# Altium project breeze_electronics_design.PrjPcb
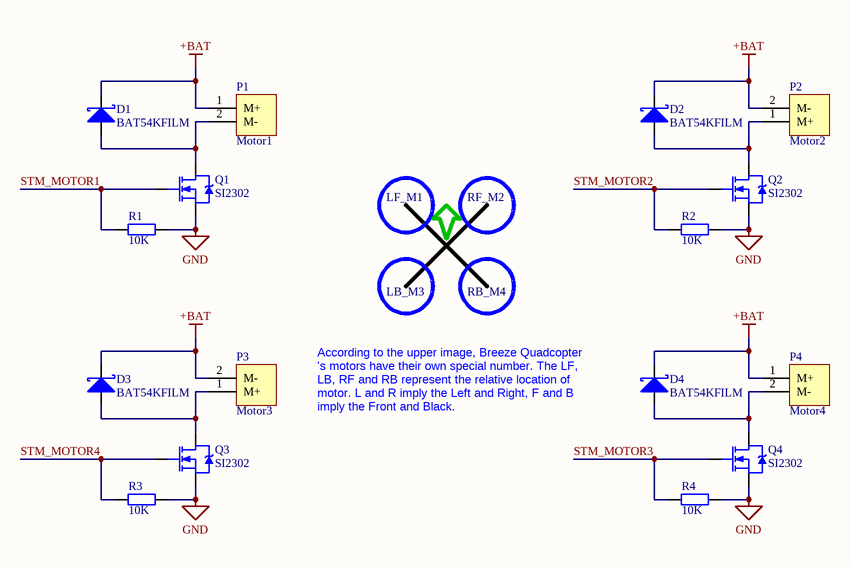
[diagram p0: breeze_motor.SchDoc]
5 sheets, 121 parts. Net scope: global (net labels, ports and power ports of the same name join across sheets).
Board file: breeze_pcb.PcbDoc
Sheets:
  breeze_motor.SchDoc
  breeze_sensor.SchDoc
  breeze_wireless.SchDoc
  breeze_power.SchDoc
  breeze_controller.SchDoc

## Sheet breeze_motor.SchDoc: Breeze Quadcopter
size A4; Author: myyerrol; Organization: Team MicroDynamics; Address1: NWPU; Address2: Xi'an; Address3: Shannxi; Address4: China; Revision: V0.1; SheetNumber: 2; SheetTotal: 5

### Parts
D1  BAT54KFILM  [SOD-523]
D2  BAT54KFILM  [SOD-523]
D3  BAT54KFILM  [SOD-523]
D4  BAT54KFILM  [SOD-523]
P1  Motor1  [HDRM-1X2]
P2  Motor2  [HDRM-1X2]
P3  Motor3  [HDRM-1X2]
P4  Motor4  [HDRM-1X2]
Q1  SI2302  [SOT-23]
Q2  SI2302  [SOT-23]
Q3  SI2302  [SOT-23]
Q4  SI2302  [SOT-23]
R1  value 10K  [SMD-0603]  (hidden comment: RES-0603)
R2  value 10K  [SMD-0603]  (hidden comment: RES-0603)
R3  value 10K  [SMD-0603]  (hidden comment: RES-0603)
R4  value 10K  [SMD-0603]  (hidden comment: RES-0603)

### Nets
+BAT: D1.2(K) D2.2(K) D3.2(K) D4.2(K) P1.1(M+) P2.2(M-) P3.2(M-) P4.1(M+)
GND: Q1.2(S) Q2.2(S) Q3.2(S) Q4.2(S) R1.2 R2.2 R3.2 R4.2
STM_MOTOR1: Q1.1(G) R1.1
STM_MOTOR2: Q2.1(G) R2.1
STM_MOTOR3: Q4.1(G) R4.1
STM_MOTOR4: Q3.1(G) R3.1
NetD1_1: D1.1(A) P1.2(M-) Q1.3(D)
NetD2_1: D2.1(A) P2.1(M+) Q2.3(D)
NetD3_1: D3.1(A) P3.1(M+) Q3.3(D)
NetD4_1: D4.1(A) P4.2(M-) Q4.3(D)

### Notes on the sheet
- LF_M1
- RF_M2
- LB_M3
- RB_M4
- According to the upper image, Breeze Quadcopter 's motors have their own special number. The LF, LB, RF and RB represent the relative location of motor. L and R imply the Left and Right, F and B  imply the Front and Black.
- Title
- Size:
- Date:
- A4
- Author:
- Time:
- Revision:
- Sheet
- of
- File:

### Library data of the parts
D1-D4 = BAT54KFILM: Schottky Diode
P1 P4 = Motor_A: Motor Header
P2 P3 = Motor_B: Motor Header
Q1-Q4 = SI2302: N-Channel Enhancement Mode Field Effect Transistor
R1-R4 = RES-0603: Resistor

## Sheet breeze_sensor.SchDoc: Breeze Quadcopter
size A4; Author: myyerrol; Organization: Team MicroDynamics; Address1: NWPU; Address2: Xi'an; Address3: Shannxi; Address4: China; Revision: V0.1; SheetNumber: 4; SheetTotal: 5
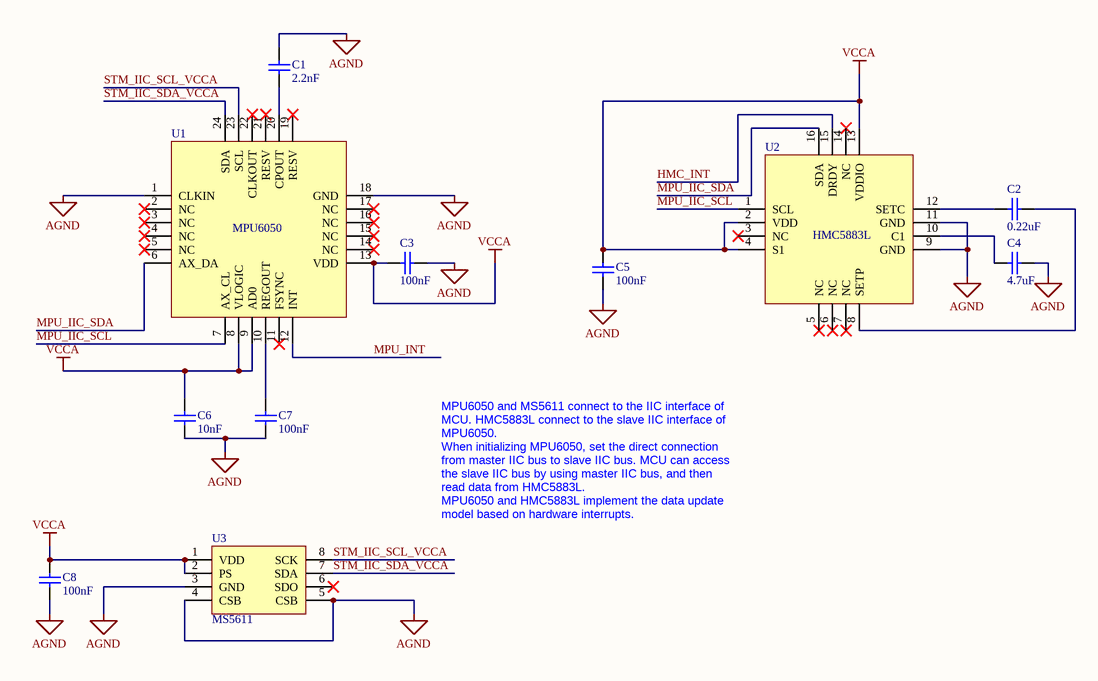
[diagram p1: breeze_sensor.SchDoc]

### Parts
C1  value 2.2nF  [SMD-0603]  (hidden comment: CAP-0603)
C2  value 0.22uF  [SMD-0603]  (hidden comment: CAP-0603)
C3  value 100nF  [SMD-0603]  (hidden comment: CAP-0603)
C4  value 4.7uF  [SMD-0603]  (hidden comment: CAP-0603)
C5  value 100nF  [SMD-0603]  (hidden comment: CAP-0603)
C6  value 10nF  [SMD-0603]  (hidden comment: CAP-0603)
C7  value 100nF  [SMD-0603]  (hidden comment: CAP-0603)
C8  value 100nF  [SMD-0603]  (hidden comment: CAP-0603)
U1  MPU6050  [QFN-24]
U2  HMC5883L  [LPCC-16]
U3  MS5611  [MS5611]

### Nets
AGND: C1.2 C3.2 C4.2 C5.2 C6.2 C7.2 C8.2 U1.1(CLKIN) U1.18(GND) U2.9(GND) U2.11(GND) U3.3(GND) U3.4(CSB) U3.5(CSB)
VCCA: C3.1 C5.1 C6.1 C8.1 U1.8(VLOGIC) U1.9(AD0) U1.13(VDD) U2.2(VDD) U2.4(S1) U2.13(VDDIO) U3.1(VDD) U3.2(PS)
HMC_INT: U2.15(DRDY)
MPU_IIC_SCL: U1.7(AX_CL) U2.1(SCL)
MPU_IIC_SDA: U1.6(AX_DA) U2.16(SDA)
MPU_INT: U1.12(INT)
STM_IIC_SCL_VCCA: U1.23(SCL) U3.8(SCK)
STM_IIC_SDA_VCCA: U1.24(SDA) U3.7(SDA)
NetC1_1: C1.1 U1.20(CPOUT)
NetC2_1: C2.1 U2.12(SETC)
NetC2_2: C2.2 U2.8(SETP)
NetC4_1: C4.1 U2.10(C1)
NetC7_1: C7.1 U1.10(REGOUT)

Not connected (* = marked no-connect by the designer): U1 2(NC)* 3(NC)* 4(NC)* 5(NC)* 11(FSYNC)* 14(NC)* 15(NC)* 16(NC)* 17(NC)* 19(RESV)* 21(RESV)* 22(CLKOUT)*; U2 3(NC)* 5(NC)* 6(NC)* 7(NC)* 14(NC)*; U3 6(SDO)*

### Notes on the sheet
- MPU6050 and MS5611 connect to the IIC interface of MCU. HMC5883L connect to the slave IIC interface of MPU6050.
  When initializing MPU6050, set the direct connection from master IIC bus to slave IIC bus. MCU can access the slave IIC bus by using master IIC bus, and then read data from HMC5883L.
  MPU6050 and HMC5883L implement the data update model based on hardware interrupts.
- Title
- Size:
- Date:
- A4
- Author:
- Time:
- Revision:
- Sheet
- of
- File:

### Library data of the parts
C1-C8 = CAP-0603: Capacitor
U1 = MPU6050: 6-axis Motion Tracking IC
U2 = HMC5883L: 3-Axis Digital Compass IC
U3 = MS5611: High Resolution Altimeter IC

## Sheet breeze_wireless.SchDoc: Breeze Quadcopter
size A4; Author: myyerrol; Organization: Team MicroDynamics; Address1: NWPU; Address2: Xi'an; Address3: Shannxi; Address4: China; Revision: V0.1; SheetNumber: 5; SheetTotal: 5
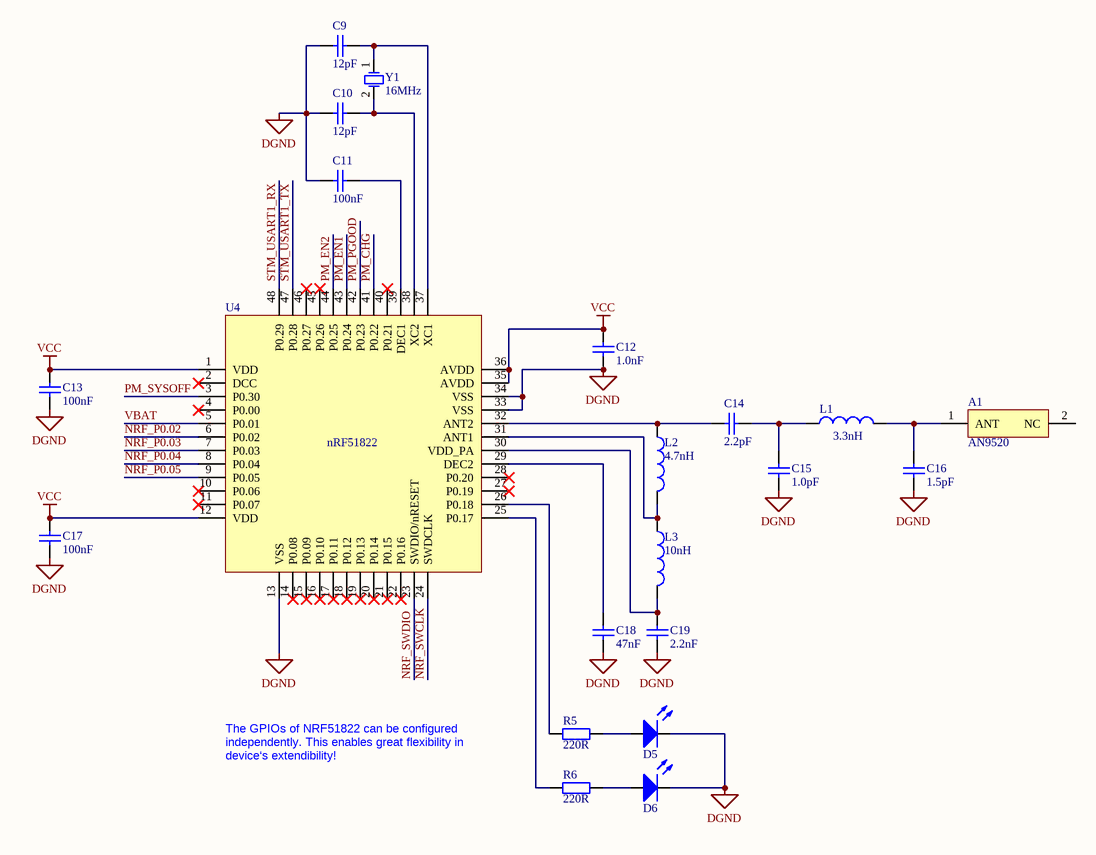
[diagram p2: breeze_wireless.SchDoc]

### Parts
A1  AN9520  [AN9520]
C9  value 12pF  [SMD-0603]  (hidden comment: CAP-0603)
C10  value 12pF  [SMD-0603]  (hidden comment: CAP-0603)
C11  value 100nF  [SMD-0603]  (hidden comment: CAP-0603)
C12  value 1.0nF  [SMD-0603]  (hidden comment: CAP-0603)
C13  value 100nF  [SMD-0603]  (hidden comment: CAP-0603)
C14  value 2.2pF  [SMD-0603]  (hidden comment: CAP-0603)
C15  value 1.0pF  [SMD-0603]  (hidden comment: CAP-0603)
C16  value 1.5pF  [SMD-0603]  (hidden comment: CAP-0603)
C17  value 100nF  [SMD-0603]  (hidden comment: CAP-0603)
C18  value 47nF  [SMD-0603]  (hidden comment: CAP-0603)
C19  value 2.2nF  [SMD-0603]  (hidden comment: CAP-0603)
D5  LED-0603  [SMD-0603]  (value not drawn)
D6  LED-0603  [SMD-0603]  (value not drawn)
L1  value 3.3nH  [SMD-0402]  (hidden comment: IND-0402)
L2  value 4.7nH  [SMD-0402]  (hidden comment: IND-0402)
L3  value 10nH  [SMD-0402]  (hidden comment: IND-0402)
R5  value 220R  [SMD-0603]  (hidden comment: RES-0603)
R6  value 220R  [SMD-0603]  (hidden comment: RES-0603)
U4  nRF51822  [QFN-48]
Y1  value 16MHz  [SMD-5032]  (hidden comment: XTAL-5032)

### Nets
DGND: C9.2 C10.2 C11.2 C12.2 C13.2 C15.2 C16.2 C17.2 C18.2 C19.2 D5.2(K) D6.2(K) U4.13(VSS) U4.33(VSS) U4.34(VSS)
VCC: C12.1 C13.1 C17.1 U4.1(VDD) U4.12(VDD) U4.35(AVDD) U4.36(AVDD)
NRF_P0.02: U4.6(P0.02)
NRF_P0.03: U4.7(P0.03)
NRF_P0.04: U4.8(P0.04)
NRF_P0.05: U4.9(P0.05)
NRF_SWCLK: U4.24(SWDCLK)
NRF_SWDIO: U4.23(SWDIO/nRESET)
PM_CHG: U4.41(P0.22)
PM_EN1: U4.43(P0.24)
PM_EN2: U4.44(P0.25)
PM_PGOOD: U4.42(P0.23)
PM_SYSOFF: U4.3(P0.30)
STM_USART1_RX: U4.48(P0.29)
STM_USART1_TX: U4.47(P0.28)
VBAT: U4.5(P0.01)
NetA1_1: A1.1(ANT) C16.1 L1.2
NetC9_1: C9.1 U4.37(XC1) Y1.1(OSC1)
NetC10_1: C10.1 U4.38(XC2) Y1.2(OSC2)
NetC11_1: C11.1 U4.39(DEC1)
NetC14_1: C14.1 L2.1 U4.32(ANT2)
NetC14_2: C14.2 C15.1 L1.1
NetC18_1: C18.1 U4.29(DEC2)
NetC19_1: C19.1 L3.2 U4.30(VDD_PA)
NetD5_1: D5.1(A) R5.2
NetD6_1: D6.1(A) R6.2
NetL2_2: L2.2 L3.1 U4.31(ANT1)
NetR5_1: R5.1 U4.26(P0.18)
NetR6_1: R6.1 U4.25(P0.17)

Not connected (* = marked no-connect by the designer): A1 2(NC); U4 2(DCC)* 4(P0.00)* 10(P0.06)* 11(P0.07)* 14(P0.08)* 15(P0.09)* 16(P0.10)* 17(P0.11)* 18(P0.12)* 19(P0.13)* 20(P0.14)* 21(P0.15)* 22(P0.16)* 27(P0.19)* 28(P0.20)* 40(P0.21)* 45(P0.26)* 46(P0.27)*

### Notes on the sheet
- The GPIOs of NRF51822 can be configured independently. This enables great flexibility in device‘s extendibility!
- Title
- Size:
- Date:
- A4
- Author:
- Time:
- Revision:
- Sheet
- of
- File:

### Library data of the parts
A1 = AN9520: 2.4GHz Wireless Communication Antenna
C9-C19 = CAP-0603: Capacitor
D5 D6 = LED-0603: LED
L1-L3 = IND-0402: Inductor
R5 R6 = RES-0603: Resistor
U4 = nRF51822: Multiprotocol Bluetooth 4.0 low energy/2.4 GHz RF SoC
Y1 = XTAL-5032: Passive Crystal Oscillator

## Sheet breeze_power.SchDoc: Breeze Quadcopter
size A4; Author: myyerrol; Organization: Team MicroDynamics; Address1: NWPU; Address2: Xi'an; Address3: Shannxi; Address4: China; Revision: V0.1; SheetNumber: 3; SheetTotal: 5
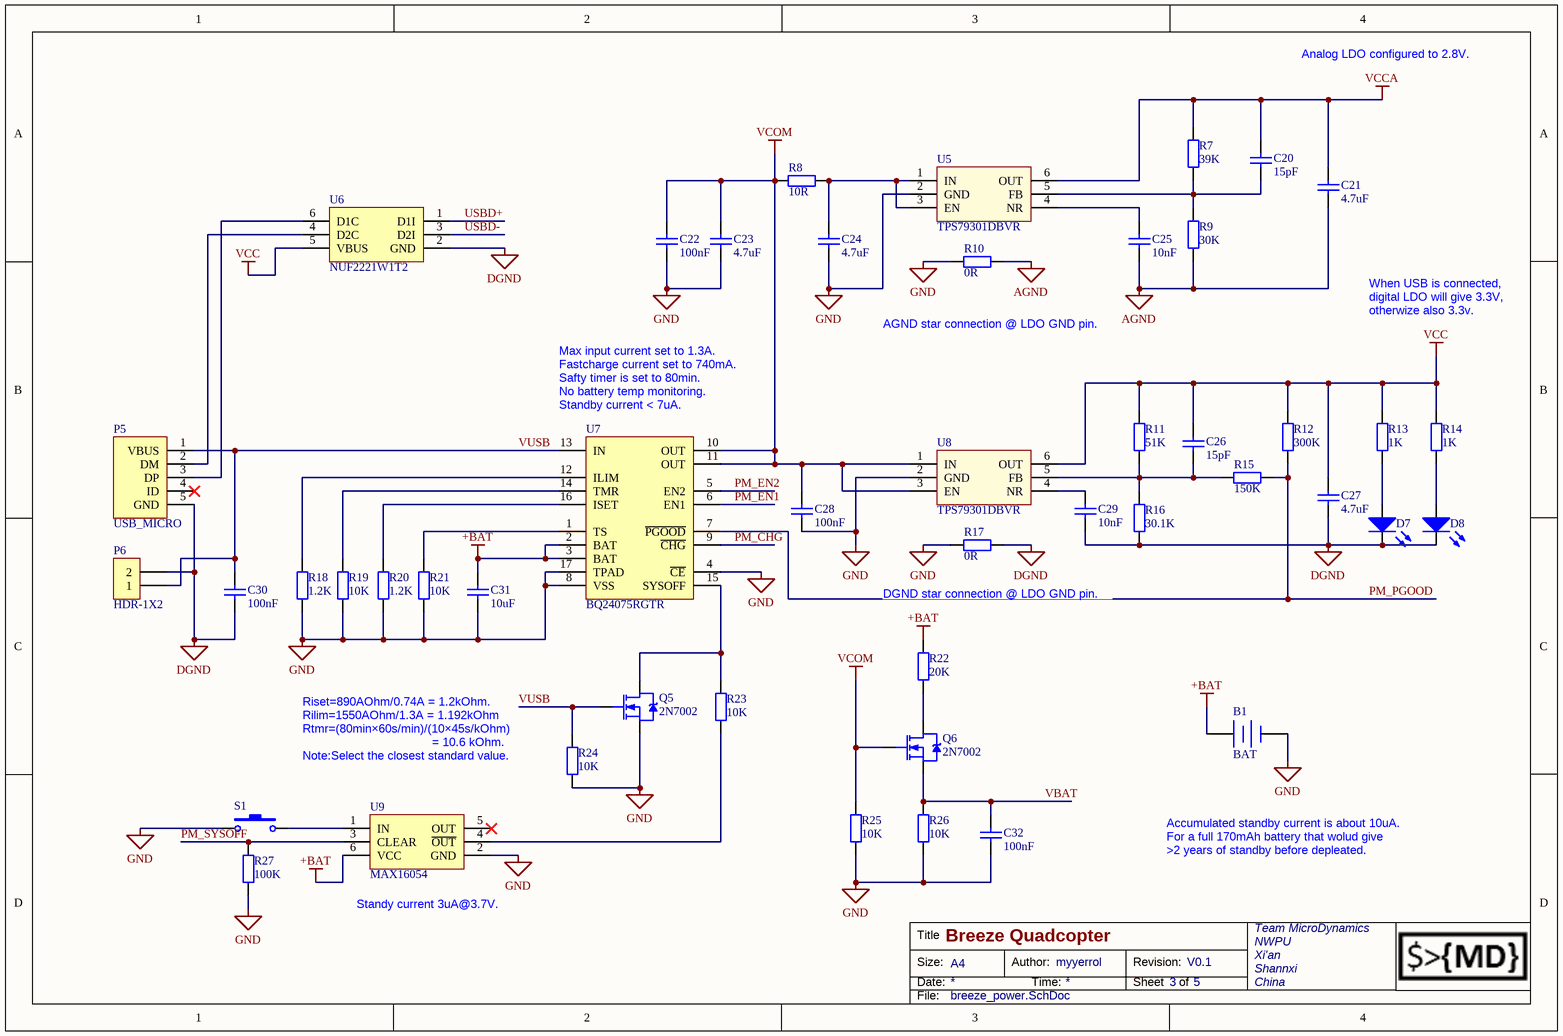
[diagram p3: breeze_power.SchDoc]

### Parts
B1  BAT  [HDR-1X2]
C20  value 15pF  [SMD-0603]  (hidden comment: CAP-0603)
C21  value 4.7uF  [SMD-0603]  (hidden comment: CAP-0603)
C22  value 100nF  [SMD-0603]  (hidden comment: CAP-0603)
C23  value 4.7uF  [SMD-0603]  (hidden comment: CAP-0603)
C24  value 4.7uF  [SMD-0603]  (hidden comment: CAP-0603)
C25  value 10nF  [SMD-0603]  (hidden comment: CAP-0603)
C26  value 15pF  [SMD-0603]  (hidden comment: CAP-0603)
C27  value 4.7uF  [SMD-0603]  (hidden comment: CAP-0603)
C28  value 100nF  [SMD-0603]  (hidden comment: CAP-0603)
C29  value 10nF  [SMD-0603]  (hidden comment: CAP-0603)
C30  value 100nF  [SMD-0603]  (hidden comment: CAP-0603)
C31  value 10uF  [SMD-0603]  (hidden comment: CAP-0603)
C32  value 100nF  [SMD-0603]  (hidden comment: CAP-0603)
D7  LED-0603  [SMD-0603]  (value not drawn)
D8  LED-0603  [SMD-0603]  (value not drawn)
P5  USB_MICRO  [USB_MICRO]
P6  HDR-1X2  [HDR-1X2]
Q5  2N7002  [SOT-23]
Q6  2N7002  [SOT-23]
R7  value 39K  [SMD-0603]  (hidden comment: RES-0603)
R8  value 10R  [SMD-0603]  (hidden comment: RES-0603)
R9  value 30K  [SMD-0603]  (hidden comment: RES-0603)
R10  value 0R  [SMD-0603]  (hidden comment: RES-0603)
R11  value 51K  [SMD-0603]  (hidden comment: RES-0603)
R12  value 300K  [SMD-0603]  (hidden comment: RES-0603)
R13  value 1K  [SMD-0603]  (hidden comment: RES-0603)
R14  value 1K  [SMD-0603]  (hidden comment: RES-0603)
R15  value 150K  [SMD-0603]  (hidden comment: RES-0603)
R16  value 30.1K  [SMD-0603]  (hidden comment: RES-0603)
R17  value 0R  [SMD-0603]  (hidden comment: RES-0603)
R18  value 1.2K  [SMD-0603]  (hidden comment: RES-0603)
R19  value 10K  [SMD-0603]  (hidden comment: RES-0603)
R20  value 1.2K  [SMD-0603]  (hidden comment: RES-0603)
R21  value 10K  [SMD-0603]  (hidden comment: RES-0603)
R22  value 20K  [SMD-0603]  (hidden comment: RES-0603)
R23  value 10K  [SMD-0603]  (hidden comment: RES-0603)
R24  value 10K  [SMD-0603]  (hidden comment: RES-0603)
R25  value 10K  [SMD-0603]  (hidden comment: RES-0603)
R26  value 10K  [SMD-0603]  (hidden comment: RES-0603)
R27  value 100K  [SMD-0603]  (hidden comment: RES-0603)
S1  SKRELGE010  [SKRELGE010]  (value not drawn)
U5  TPS79301DBVR  [SOT-23-6]
U6  NUF2221W1T2  [SOT-363]
U7  BQ24075RGTR  [VQFN-16]
U8  TPS79301DBVR  [SOT-23-6]
U9  MAX16054  [SOT-23-6]

### Nets
+BAT: B1.1(+) C31.1 R22.1 U7.2(BAT) U7.3(BAT) U9.6(VCC)
AGND: C21.2 C25.2 R9.2 R10.2
DGND: C27.2 C29.2 C30.2 D7.2(K) D8.2(K) P5.5(GND) P6.2 R16.2 R17.2 U6.2(GND)
GND: B1.2(-) C22.2 C23.2 C24.2 C28.2 C31.2 C32.2 Q5.2(S) R10.1 R17.1 R18.2 R19.2 R20.2 R21.2 R24.2 R25.2 R26.2 R27.2 S1.1 U5.2(GND) U7.4(~{CE}) U7.8(VSS) U7.17(TPAD) U8.2(GND) U9.2(GND)
VCC: C26.1 C27.1 R11.1 R12.1 R13.1 R14.1 U6.5(VBUS) U8.6(OUT)
VCCA: C20.1 C21.1 R7.1 U5.6(OUT)
VCOM: C22.1 C23.1 C28.1 Q6.1(G) R8.1 R25.1 U7.10(OUT) U7.11(OUT) U8.1(IN) U8.3(EN)
PM_CHG: U7.9(~{CHG})
PM_EN1: U7.6(EN1)
PM_EN2: U7.5(EN2)
PM_PGOOD: R12.2 R15.2 U7.7(~{PGOOD})
PM_SYSOFF: R27.1 U9.3(CLEAR)
USBD+: U6.1(D1I)
USBD-: U6.3(D2I)
VBAT: C32.1 Q6.2(S) R26.1
VUSB: C30.1 P5.1(VBUS) P6.1 Q5.1(G) R24.1 U7.13(IN)
NetC20_2: C20.2 R7.2 R9.1 U5.5(FB)
NetC24_1: C24.1 R8.2 U5.1(IN) U5.3(EN)
NetC25_1: C25.1 U5.4(NR)
NetC26_2: C26.2 R11.2 R15.1 R16.1 U8.5(FB)
NetC29_1: C29.1 U8.4(NR)
NetD7_1: D7.1(A) R13.2
NetD8_1: D8.1(A) R14.2
NetP5_2: P5.2(DM) U6.4(D2C)
NetP5_3: P5.3(DP) U6.6(D1C)
NetQ5_3: Q5.3(D) R23.1 U7.15(SYSOFF)
NetQ6_3: Q6.3(D) R22.2
NetR18_1: R18.1 U7.12(ILIM)
NetR19_1: R19.1 U7.14(TMR)
NetR20_1: R20.1 U7.16(ISET)
NetR21_1: R21.1 U7.1(TS)
NetR23_2: R23.2 U9.4(~{OUT})
NetS1_2: S1.2 U9.1(IN)

Not connected (* = marked no-connect by the designer): P5 4(ID)*; U9 5(OUT)*

### Notes on the sheet
- Analog LDO configured to 2.8V.
- When USB is connected, digital LDO will give 3.3V, otherwize also 3.3v.
- AGND star connection @ LDO GND pin.
- (near U7) Max input current set to 1.3A.
  Fastcharge current set to 740mA.
  Safty timer is set to 80min.
  No battery temp monitoring.
  Standby current < 7uA.
- DGND star connection @ LDO GND pin.
- Riset=890AOhm/0.74A = 1.2kOhm.
  Rilim=1550AOhm/1.3A = 1.192kOhm
  Rtmr=(80min×60s/min)/(10×45s/kOhm)
  = 10.6 kOhm.
  Note:Select the closest standard value.
- Accumulated standby current is about 10uA.
  For a full 170mAh battery that wolud give
  >2 years of standby before depleated.
- (near U9) Standy current 3uA@3.7V.
- Title
- Size:
- Date:
- A4
- Author:
- Time:
- Revision:
- Sheet
- of
- File:

### Library data of the parts
B1 = BAT: Battery
C20-C32 = CAP-0603: Capacitor
D7 D8 = LED-0603: LED
P5 = USB_MICRO: Micro USB
P6 = HDR-1X2: Header 1X2
Q5 Q6 = 2N7002: N-Channel Enhancement Mode Field Effect Transistor
R7-R27 = RES-0603: Resistor
S1 = SKRELGE010: Switch
U5 U8 = TPS79301DBVR: 200-mA RF Low-Dropout Regulator
U6 = NUF2221W1T2: USB Upstream Terminator  with ESD Protection
U7 = BQ24075RGTR: 1.5-A USB-Friendly Li-Ion Battery Charger and Power-Path Management IC
U9 = MAX16054: On/Off Controller with Debounce and ±15kV ESD Protection

## Sheet breeze_controller.SchDoc: Breeze Quadcopter
size A4; Author: myyerrol; Organization: Team MicroDynamics; Address1: NWPU; Address2: Xi'an; Address3: Shannxi; Address4: China; Revision: V0.1; SheetNumber: 1; SheetTotal: 5
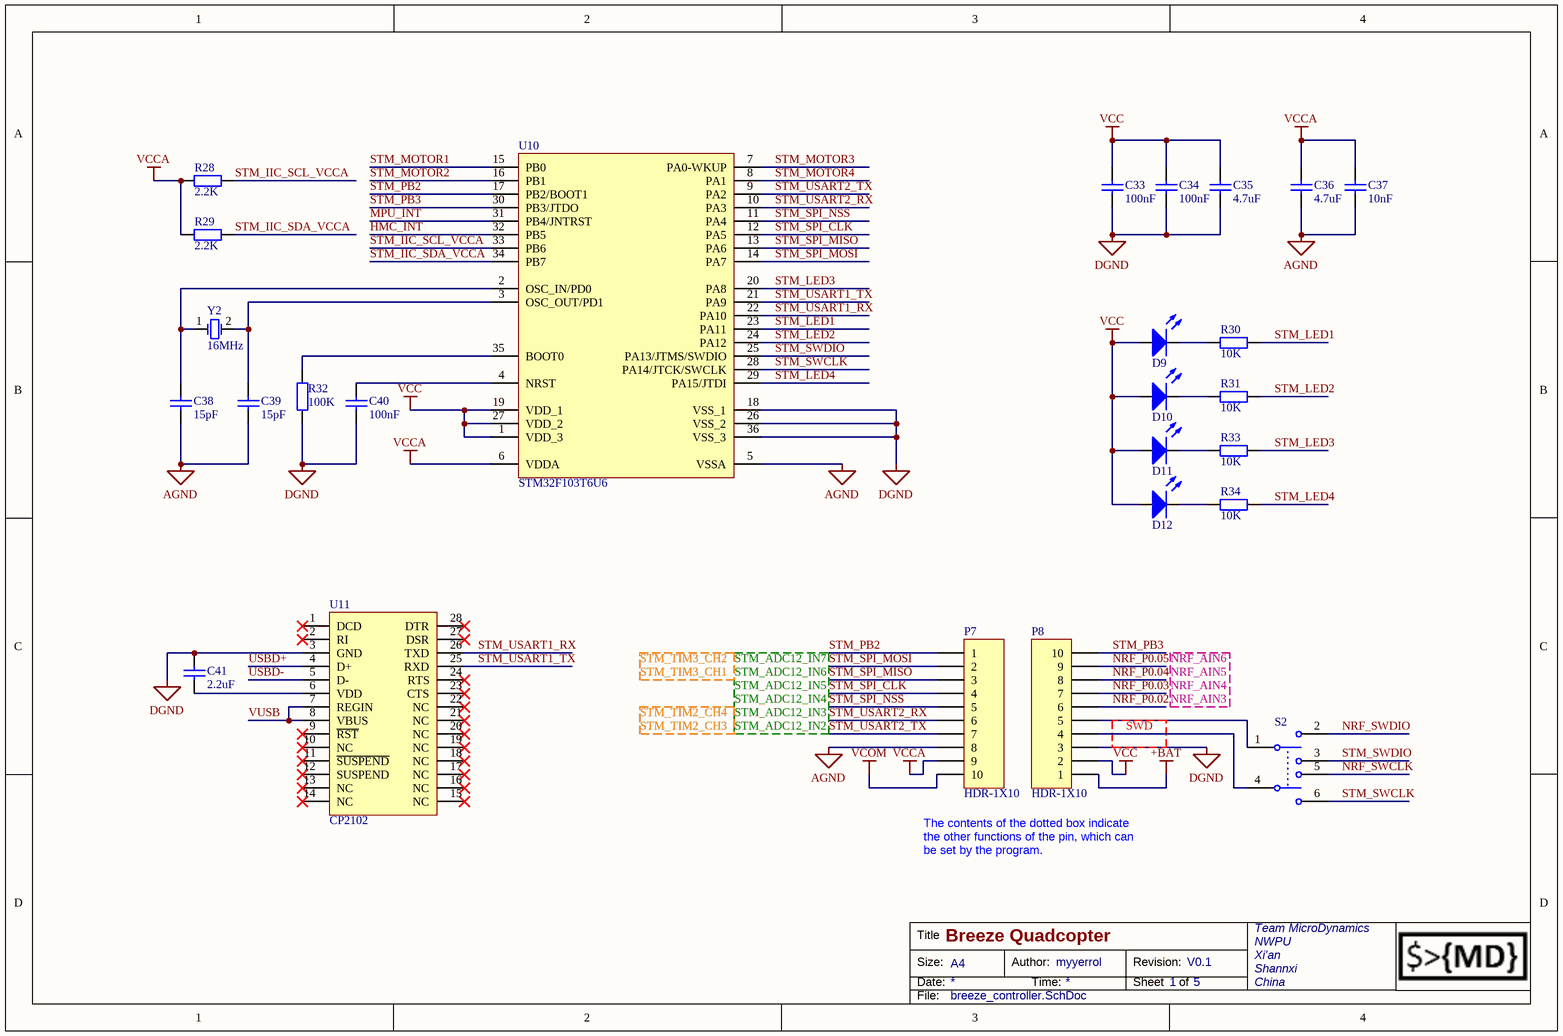
[diagram p4: breeze_controller.SchDoc]

### Parts
C33  value 100nF  [SMD-0603]  (hidden comment: CAP-0603)
C34  value 100nF  [SMD-0603]  (hidden comment: CAP-0603)
C35  value 4.7uF  [SMD-0603]  (hidden comment: CAP-0603)
C36  value 4.7uF  [SMD-0603]  (hidden comment: CAP-0603)
C37  value 10nF  [SMD-0603]  (hidden comment: CAP-0603)
C38  value 15pF  [SMD-0603]  (hidden comment: CAP-0603)
C39  value 15pF  [SMD-0603]  (hidden comment: CAP-0603)
C40  value 100nF  [SMD-0603]  (hidden comment: CAP-0603)
C41  value 2.2uF  [SMD-0603]  (hidden comment: CAP-0603)
D9  LED-0603  [SMD-0603]  (value not drawn)
D10  LED-0603  [SMD-0603]  (value not drawn)
D11  LED-0603  [SMD-0603]  (value not drawn)
D12  LED-0603  [SMD-0603]  (value not drawn)
P7  HDR-1X10  [HDR-1X10]
P8  HDR-1X10  [HDR-1X10]
R28  value 2.2K  [SMD-0603]  (hidden comment: RES-0603)
R29  value 2.2K  [SMD-0603]  (hidden comment: RES-0603)
R30  value 10K  [SMD-0603]  (hidden comment: RES-0603)
R31  value 10K  [SMD-0603]  (hidden comment: RES-0603)
R32  value 100K  [SMD-0603]  (hidden comment: RES-0603)
R33  value 10K  [SMD-0603]  (hidden comment: RES-0603)
R34  value 10K  [SMD-0603]  (hidden comment: RES-0603)
S2  MSS-22D18G2  [MSS-22D18G2]  (value not drawn)
U10  STM32F103T6U6  [VFQFPN-36]
U11  CP2102  [QFN-28]
Y2  value 16MHz  [SMD-5032]  (hidden comment: XTAL-5032)

### Nets
+BAT: P8.1
AGND: C36.2 C37.2 C38.2 C39.2 P7.8 U10.5(VSSA)
DGND: C33.2 C34.2 C35.2 C40.2 C41.2 P8.3 R32.2 U10.18(VSS_1) U10.26(VSS_2) U10.36(VSS_3) U11.3(GND)
VCC: C33.1 C34.1 C35.1 D9.1(A) D10.1(A) D11.1(A) D12.1(A) P8.2 U10.1(VDD_3) U10.19(VDD_1) U10.27(VDD_2)
VCCA: C36.1 C37.1 P7.9 R28.1 R29.1 U10.6(VDDA)
VCOM: P7.10
HMC_INT: U10.32(PB5)
MPU_INT: U10.31(PB4/JNTRST)
NRF_P0.02: P8.6
NRF_P0.03: P8.7
NRF_P0.04: P8.8
NRF_P0.05: P8.9
NRF_SWCLK: S2.5
NRF_SWDIO: S2.2
STM_IIC_SCL_VCCA: R28.2 U10.33(PB6)
STM_IIC_SDA_VCCA: R29.2 U10.34(PB7)
STM_LED1: R30.2 U10.23(PA11)
STM_LED2: R31.2 U10.24(PA12)
STM_LED3: R33.2 U10.20(PA8)
STM_LED4: R34.2 U10.29(PA15/JTDI)
STM_MOTOR1: U10.15(PB0)
STM_MOTOR2: U10.16(PB1)
STM_MOTOR3: U10.7(PA0-WKUP)
STM_MOTOR4: U10.8(PA1)
STM_PB2: P7.1 U10.17(PB2/BOOT1)
STM_PB3: P8.10 U10.30(PB3/JTDO)
STM_SPI_CLK: P7.4 U10.12(PA5)
STM_SPI_MISO: P7.3 U10.13(PA6)
STM_SPI_MOSI: P7.2 U10.14(PA7)
STM_SPI_NSS: P7.5 U10.11(PA4)
STM_SWCLK: S2.6 U10.28(PA14/JTCK/SWCLK)
STM_SWDIO: S2.3 U10.25(PA13/JTMS/SWDIO)
STM_USART1_RX: U10.22(PA10) U11.26(TXD)
STM_USART1_TX: U10.21(PA9) U11.25(RXD)
STM_USART2_RX: P7.6 U10.10(PA3)
STM_USART2_TX: P7.7 U10.9(PA2)
USBD+: U11.4(D+)
USBD-: U11.5(D-)
VUSB: U11.7(REGIN) U11.8(VBUS)
NetC38_1: C38.1 U10.2(OSC_IN/PD0) Y2.1(OSC1)
NetC39_1: C39.1 U10.3(OSC_OUT/PD1) Y2.2(OSC2)
NetC40_1: C40.1 U10.4(NRST)
NetC41_1: C41.1 U11.6(VDD)
NetD9_2: D9.2(K) R30.1
NetD10_2: D10.2(K) R31.1
NetD11_2: D11.2(K) R33.1
NetD12_2: D12.2(K) R34.1
NetP8_4: P8.4 S2.4
NetP8_5: P8.5 S2.1
NetR32_1: R32.1 U10.35(BOOT0)

Not connected (* = marked no-connect by the designer): U11 1(DCD)* 2(RI)* 9(~{RST})* 10(NC)* 11(~{SUSPEND})* 12(SUSPEND)* 13(NC)* 14(NC)* 15(NC)* 16(NC)* 17(NC)* 18(NC)* 19(NC)* 20(NC)* 21(NC)* 22(NC)* 23(CTS)* 24(RTS)* 27(DSR)* 28(DTR)*

### Notes on the sheet
- STM_TIM3_CH2
- STM_TIM3_CH1
- STM_TIM2_CH4
- STM_ADC12_IN6
- STM_ADC12_IN5
- STM_ADC12_IN4
- STM_ADC12_IN3
- STM_ADC12_IN7
- NRF_AIN6
- NRF_AIN5
- NRF_AIN4
- NRF_AIN3
- STM_TIM2_CH3
- STM_ADC12_IN2
- SWD
- The contents of the dotted box indicate the other functions of the pin, which can be set by the program.
- Title
- Size:
- Date:
- A4
- Author:
- Time:
- Revision:
- Sheet
- of
- File:

### Library data of the parts
C33-C41 = CAP-0603: Capacitor
D9-D12 = LED-0603: LED
P7 P8 = HDR-1X10: Header 1X10
R28-R34 = RES-0603: Resistor
S2 = MSS-22D18G2: Double-Pole, Double-Throw Switch
U10 = STM32F103T6U6: ARM Cortex-M3 MCU
U11 = CP2102: Highly-integrated USB-to-UART Bridge Controller
Y2 = XTAL-5032: Passive Crystal Oscillator

## Nets that join several sheets
+BAT: breeze_motor (8 pins), breeze_power (6 pins), breeze_controller (P8.1)
AGND: breeze_sensor (14 pins), breeze_power (C21.2 C25.2 R9.2 R10.2), breeze_controller (6 pins)
DGND: breeze_wireless (15 pins), breeze_power (10 pins), breeze_controller (11 pins)
GND: breeze_motor (8 pins), breeze_power (25 pins)
VCC: breeze_wireless (7 pins), breeze_power (8 pins), breeze_controller (11 pins)
VCCA: breeze_sensor (12 pins), breeze_power (C20.1 C21.1 R7.1 U5.6), breeze_controller (6 pins)
VCOM: breeze_power (10 pins), breeze_controller (P7.10)
HMC_INT: breeze_sensor (U2.15), breeze_controller (U10.32)
MPU_INT: breeze_sensor (U1.12), breeze_controller (U10.31)
NRF_P0.02: breeze_wireless (U4.6), breeze_controller (P8.6)
NRF_P0.03: breeze_wireless (U4.7), breeze_controller (P8.7)
NRF_P0.04: breeze_wireless (U4.8), breeze_controller (P8.8)
NRF_P0.05: breeze_wireless (U4.9), breeze_controller (P8.9)
NRF_SWCLK: breeze_wireless (U4.24), breeze_controller (S2.5)
NRF_SWDIO: breeze_wireless (U4.23), breeze_controller (S2.2)
PM_CHG: breeze_wireless (U4.41), breeze_power (U7.9)
PM_EN1: breeze_wireless (U4.43), breeze_power (U7.6)
PM_EN2: breeze_wireless (U4.44), breeze_power (U7.5)
PM_PGOOD: breeze_wireless (U4.42), breeze_power (R12.2 R15.2 U7.7)
PM_SYSOFF: breeze_wireless (U4.3), breeze_power (R27.1 U9.3)
STM_IIC_SCL_VCCA: breeze_sensor (U1.23 U3.8), breeze_controller (R28.2 U10.33)
STM_IIC_SDA_VCCA: breeze_sensor (U1.24 U3.7), breeze_controller (R29.2 U10.34)
STM_MOTOR1: breeze_motor (Q1.1 R1.1), breeze_controller (U10.15)
STM_MOTOR2: breeze_motor (Q2.1 R2.1), breeze_controller (U10.16)
STM_MOTOR3: breeze_motor (Q4.1 R4.1), breeze_controller (U10.7)
STM_MOTOR4: breeze_motor (Q3.1 R3.1), breeze_controller (U10.8)
STM_USART1_RX: breeze_wireless (U4.48), breeze_controller (U10.22 U11.26)
STM_USART1_TX: breeze_wireless (U4.47), breeze_controller (U10.21 U11.25)
USBD+: breeze_power (U6.1), breeze_controller (U11.4)
USBD-: breeze_power (U6.3), breeze_controller (U11.5)
VBAT: breeze_wireless (U4.5), breeze_power (C32.1 Q6.2 R26.1)
VUSB: breeze_power (6 pins), breeze_controller (U11.7 U11.8)